# EAGLE design Telex-O (EAGLE 7.5.0)

## Sheet 1 of 2: POWER & IO
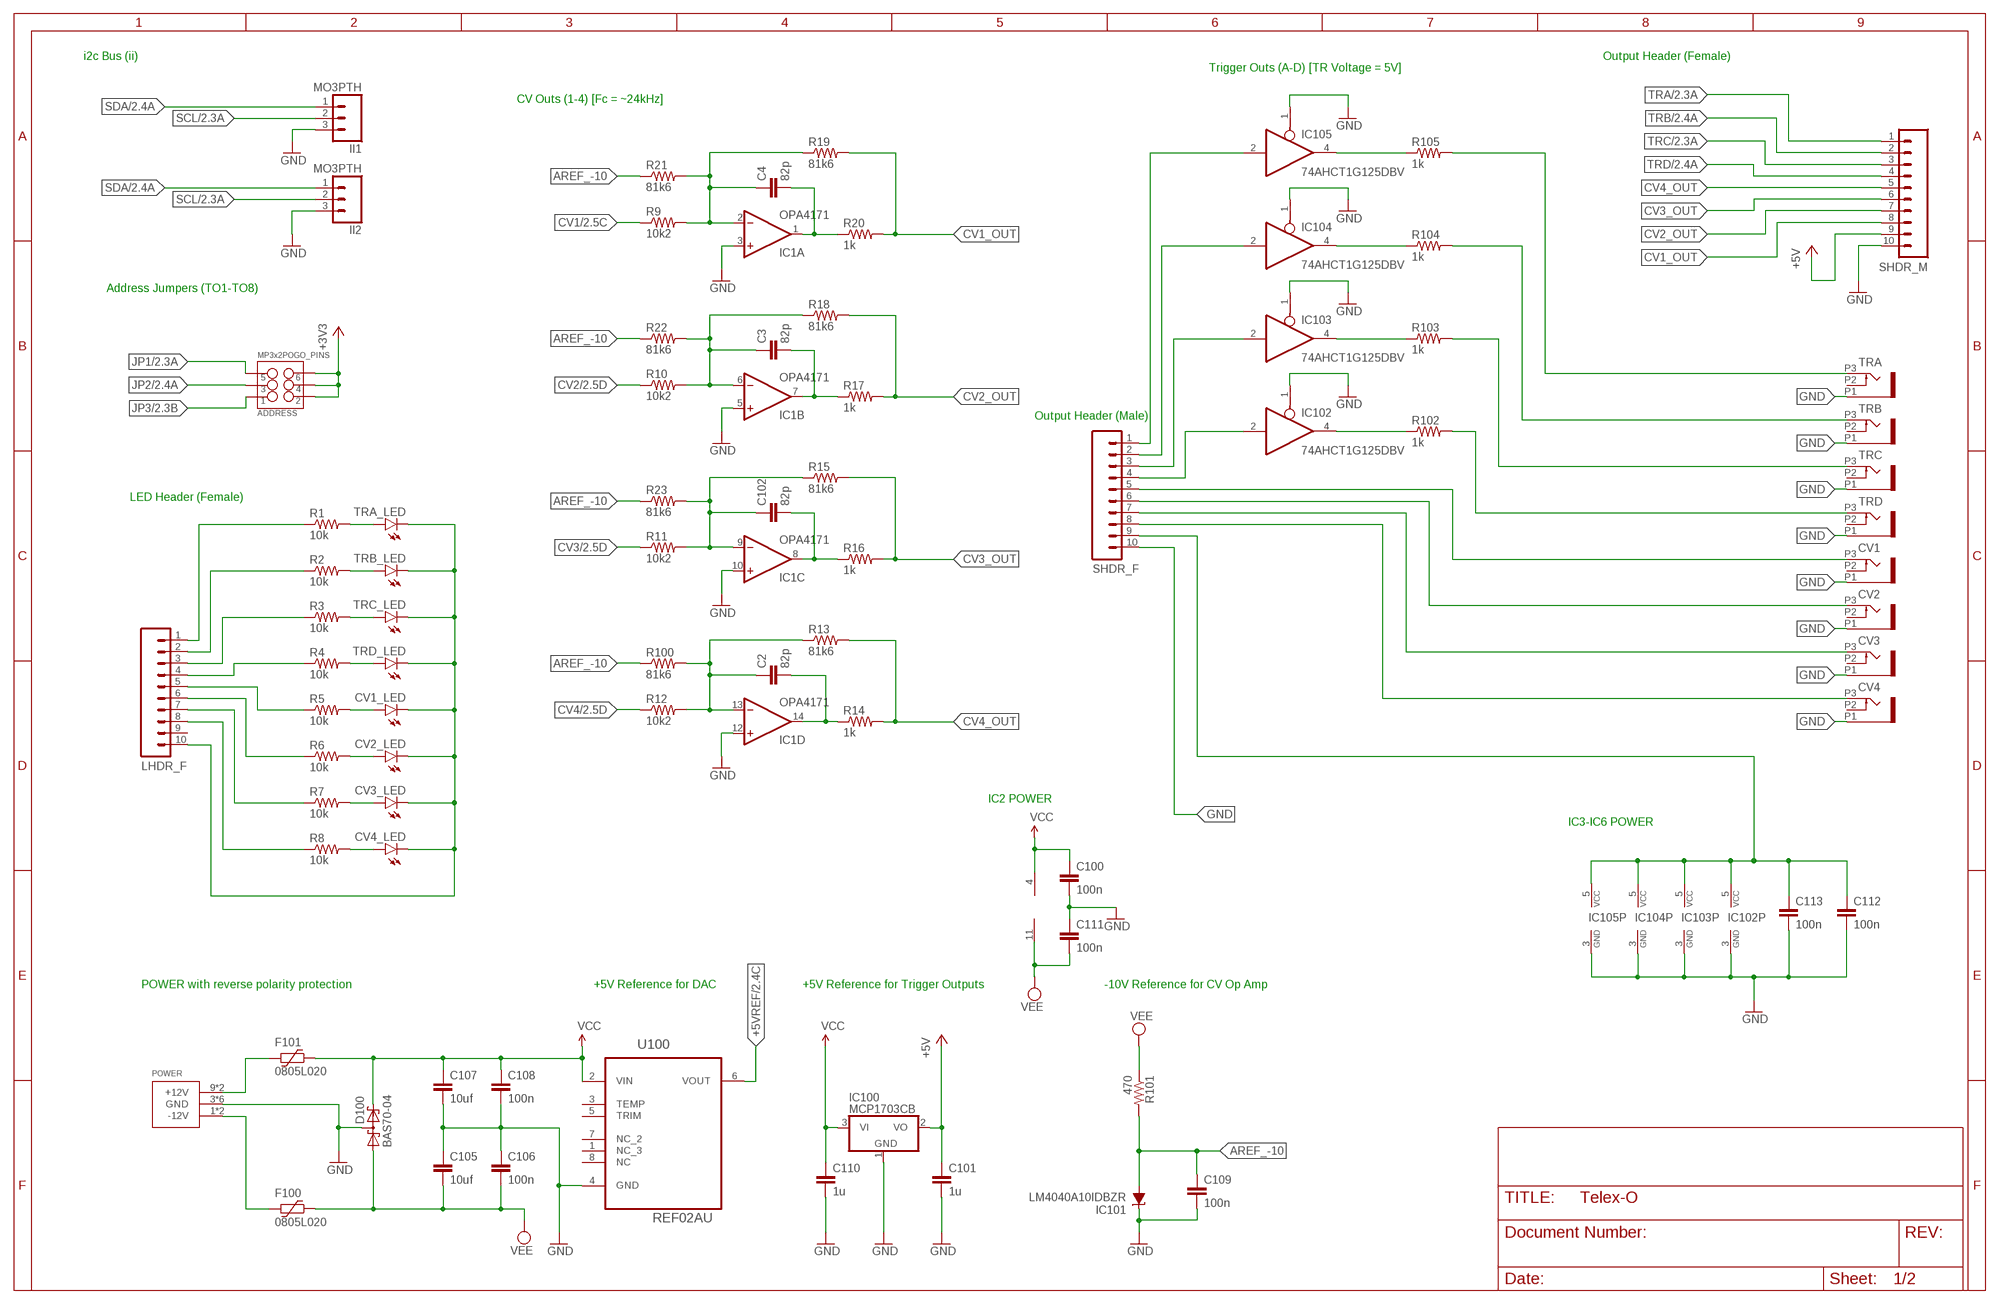
[diagram p0: schematic, sheet 1]

### Parts
ADDRESS  MP3x2POGO_PINS  M03X2POGO_PINS  [2X3_POGO]
C2  82p  CAP1206  [1206]
C3  82p  CAP1206  [1206]
C4  82p  CAP1206  [1206]
C100  100n  CAP0603-CAP  [0603-CAP]
C101  1u  CAP0603-CAP  [0603-CAP]
C102  82p  CAP1206  [1206]
C105  10uf  CAP1206  [1206]
C106  100n  CAP0603-CAP  [0603-CAP]
C107  10uf  CAP1206  [1206]
C108  100n  CAP0603-CAP  [0603-CAP]
C109  100n  CAP0603-CAP  [0603-CAP]
C110  1u  CAP0603-CAP  [0603-CAP]
C111  100n  CAP0603-CAP  [0603-CAP]
C112  100n  CAP0603-CAP  [0603-CAP]
C113  100n  CAP0603-CAP  [0603-CAP]
CV1  EURO_JACKS-7  [WQP_PJ_301M]
CV1_LED  LED3MM  [LED3MM]
CV2  EURO_JACKS-7  [WQP_PJ_301M]
CV2_LED  LED3MM  [LED3MM]
CV3  EURO_JACKS-7  [WQP_PJ_301M]
CV3_LED  LED3MM  [LED3MM]
CV4  EURO_JACKS-7  [WQP_PJ_301M]
CV4_LED  LED3MM  [LED3MM]
D100  BAS70-04  [SOT23]
F100  0805L020  [0805L]
F101  0805L020  [0805L]
IC1  OPA4171  TL074D  [SO14]
IC100  MCP1703CB  [SOT23]
IC101  LM4040A10IDBZR  LM4041A12DBZ  [DBZ_R-PDSO-G3]
IC102  74AHCT1G125DBV  [SOT23-5]
IC103  74AHCT1G125DBV  [SOT23-5]
IC104  74AHCT1G125DBV  [SOT23-5]
IC105  74AHCT1G125DBV  [SOT23-5]
II1  MO3PTH  M03PTH  [1X03]
II2  MO3PTH  M03PTH  [1X03]
LHDR_F  M10SILK_FEMALE_PTH  [1X10]
POWER  10-Pin  POWER_SIMPLE10  [POWER_10]
R1  10k  R-US_R0603  [R0603]
R2  10k  R-US_R0603  [R0603]
R3  10k  R-US_R0603  [R0603]
R4  10k  R-US_R0603  [R0603]
R5  10k  R-US_R0603  [R0603]
R6  10k  R-US_R0603  [R0603]
R7  10k  R-US_R0603  [R0603]
R8  10k  R-US_R0603  [R0603]
R9  10k2  R-US_R0603  [R0603]
R10  10k2  R-US_R0603  [R0603]
R11  10k2  R-US_R0603  [R0603]
R12  10k2  R-US_R0603  [R0603]
R13  81k6  R-US_R0603  [R0603]
R14  1k  R-US_R0603  [R0603]
R15  81k6  R-US_R0603  [R0603]
R16  1k  R-US_R0603  [R0603]
R17  1k  R-US_R0603  [R0603]
R18  81k6  R-US_R0603  [R0603]
R19  81k6  R-US_R0603  [R0603]
R20  1k  R-US_R0603  [R0603]
R21  81k6  R-US_R0603  [R0603]
R22  81k6  R-US_R0603  [R0603]
R23  81k6  R-US_R0603  [R0603]
R100  81k6  R-US_R0603  [R0603]
R101  470  R-US_R0603  [R0603]
R102  1k  R-US_R0603  [R0603]
R103  1k  R-US_R0603  [R0603]
R104  1k  R-US_R0603  [R0603]
R105  1k  R-US_R0603  [R0603]
SHDR_F  M10SILK_FEMALE_PTH  [1X10]
SHDR_M  M10SILK_FEMALE_PTH  [1X10]
TRA  EURO_JACKS-7  [WQP_PJ_301M]
TRA_LED  LED3MM  [LED3MM]
TRB  EURO_JACKS-7  [WQP_PJ_301M]
TRB_LED  LED3MM  [LED3MM]
TRC  EURO_JACKS-7  [WQP_PJ_301M]
TRC_LED  LED3MM  [LED3MM]
TRD  EURO_JACKS-7  [WQP_PJ_301M]
TRD_LED  LED3MM  [LED3MM]
U100  REF02AU  [SOIC127P600X175-8N]

### Nets
+3V3: ADDRESS.P$2 ADDRESS.P$4 ADDRESS.P$6 ; also sheet 2
+5V: C101.1 IC100.2(VO) SHDR_M.9 ; also sheet 2
+5VREF: U100.6(VOUT) ; also sheet 2
AREF_-10: C109.1 IC101.2(A) R21.1 R22.1 R23.1 R100.1 R101.2
CV1: R9.1 ; also sheet 2
CV1_OUT: R19.2 R20.2 SHDR_M.8
CV2: R10.1 ; also sheet 2
CV2_OUT: R17.2 R18.2 SHDR_M.7
CV3: R11.1 ; also sheet 2
CV3_OUT: R15.2 R16.2 SHDR_M.6
CV4: R12.1 ; also sheet 2
CV4_OUT: R13.2 R14.2 SHDR_M.5
GND: C100.2 C101.2 C105.1 C106.1 C107.2 C108.2 C109.2 C110.2 C111.1 C112.2 C113.2 CV1.P1 CV1_LED.K(C) CV2.P1 CV2_LED.K(C) CV3.P1 CV3_LED.K(C) CV4.P1 CV4_LED.K(C) D100.3(C1A2) IC1.3(A:+IN) IC1.5(B:+IN) IC1.10(C:+IN) IC1.12(D:+IN) IC100.1(GND) IC101.1(C) IC102.1(OE) IC102.3(GND) IC103.1(OE) IC103.3(GND) IC104.1(OE) IC104.3(GND) IC105.1(OE) IC105.3(GND) II1.3 II2.3 LHDR_F.10 POWER.3(GND) POWER.4(GND) POWER.5(GND) POWER.6(GND) POWER.7(GND) POWER.8(GND) SHDR_F.10 SHDR_M.10 TRA.P1 TRA_LED.K(C) TRB.P1 TRB_LED.K(C) TRC.P1 TRC_LED.K(C) TRD.P1 TRD_LED.K(C) U100.4(GND) ; also sheet 2
JP1: ADDRESS.P$5 ; also sheet 2
JP2: ADDRESS.P$3 ; also sheet 2
JP3: ADDRESS.P$1 ; also sheet 2
M$22: C4.1 IC1.2(A:-IN) R9.2 R19.1 R21.2
N$2: F101.2 POWER.9(+12V) POWER.10(+12V)
N$3: F100.2 POWER.1(-12V) POWER.2(-12V)
N$5: CV4_LED.A R8.2
N$7: IC105.2(I) SHDR_F.1
N$9: CV3_LED.A R7.2
N$10: CV2_LED.A R6.2
N$11: CV1_LED.A R5.2
N$12: R4.2 TRD_LED.A
N$13: R3.2 TRC_LED.A
N$14: R2.2 TRB_LED.A
N$15: R1.2 TRA_LED.A
N$17: IC104.2(I) SHDR_F.2
N$18: IC103.2(I) SHDR_F.3
N$19: C4.2 IC1.1(A:OUT) R20.1
N$20: IC102.2(I) SHDR_F.4
N$21: C3.2 IC1.7(B:OUT) R17.1
N$22: C3.1 IC1.6(B:-IN) R10.2 R18.1 R22.2
N$23: R102.2 TRD.P3
N$24: R103.2 TRC.P3
N$25: C102.2 IC1.8(C:OUT) R16.1
N$26: C102.1 IC1.9(C:-IN) R11.2 R15.1 R23.2
N$27: LHDR_F.1 R1.1
N$28: C2.2 IC1.14(D:OUT) R14.1
N$29: C2.1 IC1.13(D:-IN) R12.2 R13.1 R100.2
N$30: LHDR_F.2 R2.1
N$31: LHDR_F.3 R3.1
N$32: LHDR_F.4 R4.1
N$33: IC102.4(O) R102.1
N$34: IC103.4(O) R103.1
N$35: IC104.4(O) R104.1
N$36: IC105.4(O) R105.1
N$37: R104.2 TRB.P3
N$38: R105.2 TRA.P3
N$39: C112.1 C113.1 IC102.5(VCC) IC103.5(VCC) IC104.5(VCC) IC105.5(VCC) SHDR_F.9
N$40: CV3.P3 SHDR_F.7
N$41: LHDR_F.5 R5.1
N$42: LHDR_F.6 R6.1
N$43: LHDR_F.7 R7.1
N$44: LHDR_F.8 R8.1
N$45: CV1.P3 SHDR_F.5
N$46: CV2.P3 SHDR_F.6
N$47: CV4.P3 SHDR_F.8
SCL: II1.2 II2.2 ; also sheet 2
SDA: II1.1 II2.1 ; also sheet 2
TRA: SHDR_M.1 ; also sheet 2
TRB: SHDR_M.2 ; also sheet 2
TRC: SHDR_M.3 ; also sheet 2
TRD: SHDR_M.4 ; also sheet 2
VCC: C100.1 C107.1 C108.1 C110.1 D100.2(C2) F101.1 IC1.4(P:V+) IC100.3(VI) U100.2(VIN)
VEE: C105.2 C106.2 C111.2 D100.1(A1) F100.1 IC1.11(P:V-) R101.1
Unconnected: CV1.P2 CV2.P2 CV3.P2 CV4.P2 LHDR_F.9 TRA.P2 TRB.P2 TRC.P2 TRD.P2 U100.1(NC_3) U100.3(TEMP) U100.5(TRIM) U100.7(NC_2) U100.8(NC)

### Notes on the sheet
- i2c Bus (ii) | Output Header (Female)
- Trigger Outs (A-D) [TR Voltage = 5V]
- CV Outs (1-4) [Fc = ~24kHz]
- Address Jumpers (TO1-TO8)
- Output Header (Male)
- LED Header (Female)
- IC2 POWER
- IC3-IC6 POWER
- POWER with reverse polarity protection | +5V Reference for DAC | +5V Reference for Trigger Outputs | -10V Reference for CV Op Amp

## Sheet 2 of 2: LOGIC
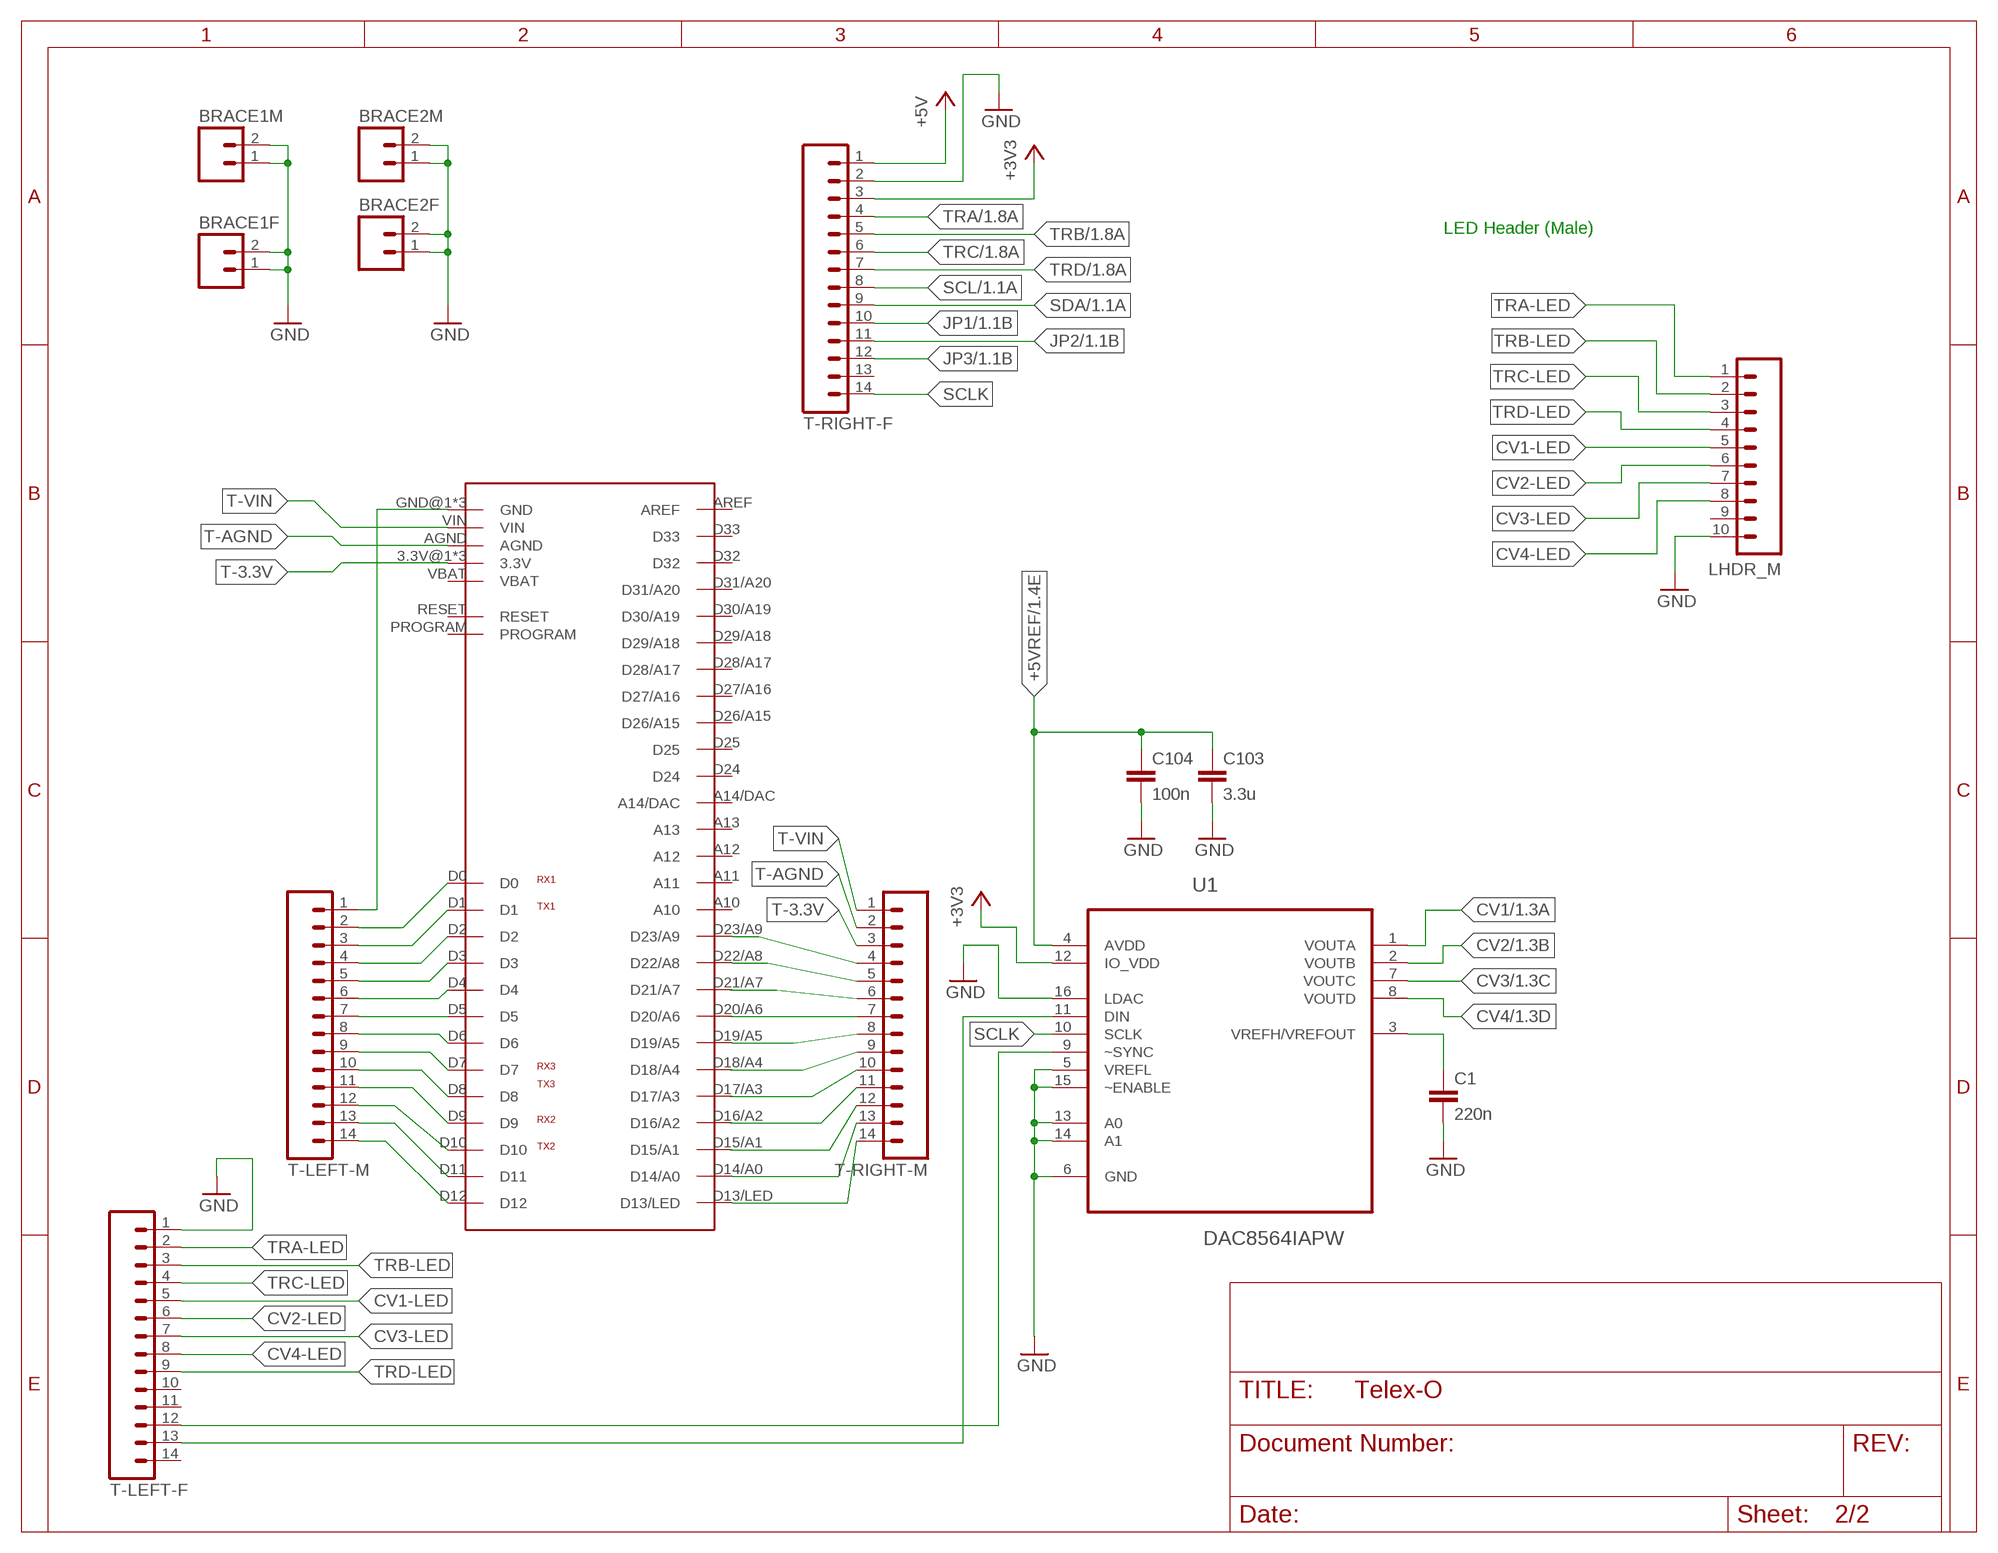
[diagram p1: schematic, sheet 2]

### Parts
BRACE1F  M02PTH  [1X02]
BRACE1M  M02PTH  [1X02]
BRACE2F  M02PTH  [1X02]
BRACE2M  M02PTH  [1X02]
C1  220n  CAP0603-CAP  [0603-CAP]
C103  3.3u  CAP1206  [1206]
C104  100n  CAP0603-CAP  [0603-CAP]
LHDR_M  M10SILK_FEMALE_PTH  [1X10]
T-LEFT-F  M14  [1X14]
T-LEFT-M  M14  [1X14]
T-RIGHT-F  M14  [1X14]
T-RIGHT-M  M14  [1X14]
U1  DAC8564IAPW  [SOP65P640X120-16N]
U$1  TEENSY3.1_ALL  [TEENSY3.1_ALL]

### Nets
+3V3: T-RIGHT-F.3 U1.12(IO_VDD) ; also sheet 1
+5V: T-RIGHT-F.1 ; also sheet 1
+5VREF: C103.1 C104.1 U1.4(AVDD) ; also sheet 1
CV1: U1.1(VOUTA) ; also sheet 1
CV1-LED: LHDR_M.5 T-LEFT-F.5
CV2: U1.2(VOUTB) ; also sheet 1
CV2-LED: LHDR_M.6 T-LEFT-F.6
CV3: U1.7(VOUTC) ; also sheet 1
CV3-LED: LHDR_M.7 T-LEFT-F.7
CV4: U1.8(VOUTD) ; also sheet 1
CV4-LED: LHDR_M.8 T-LEFT-F.8
GND: BRACE1F.1 BRACE1F.2 BRACE1M.1 BRACE1M.2 BRACE2F.1 BRACE2F.2 BRACE2M.1 BRACE2M.2 C1.2 C103.2 C104.2 LHDR_M.10 T-LEFT-F.1 T-RIGHT-F.2 U1.5(VREFL) U1.6(GND) U1.13(A0) U1.14(A1) U1.15(~ENABLE) U1.16(LDAC) ; also sheet 1
JP1: T-RIGHT-F.10 ; also sheet 1
JP2: T-RIGHT-F.11 ; also sheet 1
JP3: T-RIGHT-F.12 ; also sheet 1
N$1: T-RIGHT-M.14 U$1.D13/LED
N$4: T-LEFT-F.12 U1.9(~SYNC)
N$6: T-LEFT-F.13 U1.11(DIN)
N$8: C1.1 U1.3(VREFH/VREFOUT)
N$16: T-LEFT-M.2 U$1.D0
N$48: T-LEFT-M.3 U$1.D1
N$49: T-LEFT-M.4 U$1.D2
N$50: T-LEFT-M.5 U$1.D3
N$51: T-LEFT-M.6 U$1.D4
N$52: T-LEFT-M.7 U$1.D5
N$53: T-LEFT-M.8 U$1.D6
N$54: T-LEFT-M.9 U$1.D7
N$55: T-LEFT-M.12 U$1.D10
N$56: T-LEFT-M.13 U$1.D11
N$57: T-LEFT-M.1 U$1.GND@1(GND) U$1.GND@2(GND) U$1.GND@3(GND)
N$58: T-LEFT-M.10 U$1.D8
N$59: T-LEFT-M.11 U$1.D9
N$60: T-LEFT-M.14 U$1.D12
N$61: T-RIGHT-M.13 U$1.D14/A0
N$62: T-RIGHT-M.12
N$63: T-RIGHT-M.11
N$64: T-RIGHT-M.10
N$65: T-RIGHT-M.9
N$66: T-RIGHT-M.8 U$1.D19/A5
N$67: T-RIGHT-M.7
N$68: T-RIGHT-M.6
N$69: T-RIGHT-M.5 U$1.D22/A8
N$70: T-RIGHT-M.4 U$1.D23/A9
SCL: T-RIGHT-F.8 ; also sheet 1
SCLK: T-RIGHT-F.14 U1.10(SCLK)
SDA: T-RIGHT-F.9 ; also sheet 1
T-3.3V: T-RIGHT-M.3 U$1.3.3V@1(3.3V) U$1.3.3V@2(3.3V) U$1.3.3V@3(3.3V)
T-AGND: T-RIGHT-M.2 U$1.AGND
T-VIN: T-RIGHT-M.1 U$1.VIN
TRA: T-RIGHT-F.4 ; also sheet 1
TRA-LED: LHDR_M.1 T-LEFT-F.2
TRB: T-RIGHT-F.5 ; also sheet 1
TRB-LED: LHDR_M.2 T-LEFT-F.3
TRC: T-RIGHT-F.6 ; also sheet 1
TRC-LED: LHDR_M.3 T-LEFT-F.4
TRD: T-RIGHT-F.7 ; also sheet 1
TRD-LED: LHDR_M.4 T-LEFT-F.9
Unconnected: LHDR_M.9 T-LEFT-F.10 T-LEFT-F.11 T-LEFT-F.14 T-RIGHT-F.13 U$1.A10 U$1.A11 U$1.A12 U$1.A13 U$1.A14/DAC U$1.AREF U$1.D15/A1 U$1.D16/A2 U$1.D17/A3 U$1.D18/A4 U$1.D20/A6 U$1.D21/A7 U$1.D24 U$1.D25 U$1.D26/A15 U$1.D27/A16 U$1.D28/A17 U$1.D29/A18 U$1.D30/A19 U$1.D31/A20 U$1.D32 U$1.D33 U$1.PROGRAM U$1.RESET U$1.VBAT

### Notes on the sheet
- LED Header (Male)

## Library data of the parts
ADDRESS = SparkFun-Connectors:M03X2: 2x3 .1" header. Shrouded, with keying- CONN-10681 SMT- CONN-11415 Pogo pins- HW-11044; PROD_ID: HW-11044
BRACE1F BRACE1M BRACE2F BRACE2M = SparkFun-Connectors:M02: Standard 2-pin 0.1" header. Use with - straight break away headers ( PRT-00116) - right angle break away headers (PRT-00553) - swiss pins (PRT-00743) - machine pins (PRT-00117) - female headers (PRT-00115) Molex polarized connector foot print use with: PRT-08233 with associated crimp pins and housings. 2.54_SCREWTERM for use with PRT-10571. 3.5mm Screw Terminal footprints for PRT-08084 5mm Screw Terminal footprints for use with PRT-08432
C1-C4 C100-C113 = SparkFun-Passives:CAP: Capacitor Standard 0603 ceramic capacitor, and 0.1" leaded capacitor.
CV1-CV4 TRA TRB TRC TRD = tsyklon-labs:EURO_JACKS
CV1_LED CV2_LED CV3_LED CV4_LED TRA_LED TRB_LED TRC_LED TRD_LED = SparkFun-LED:LED: LEDs Standard schematic elements and footprints for 5mm, 3mm, 1206, and 0603 sized LEDs. 5mm - Spark Fun Electronics SKU : COM-00529 (and others); PROD_ID: DIO-08794
D100 = diode:BAS70-04: Silicon Schottky Diodes General-purpose diode for high-speed switching
F100 F101 = polyfuse-smd_10:?: Polyfuse Resettable PTC Source: http://www.littelfuse.com/products/resettable-ptcs.aspx; MF: Littelfuse; MPN: 0805L020; OC_FARNELL: 1832107; OC_NEWARK: 05M2226
IC1 = linear:TL074: OP AMP
IC100 = linear:MCP1703: 250 mA, 16V, Low Quiescent Current LDO Regulator Source: http://ww1.microchip.com/downloads/en/DeviceDoc/22049b.pdf
IC101 = texas:LM4041: PRECISION MICROPOWER SHUNT VOLTAGE REFERENCE Source: http://focus.ti.com/lit/ds/slcs146e/slcs146e.pdf; MPN: LM4041A12IDBZR; OC_FARNELL: 1407949; OC_NEWARK: 58K5875
IC102-IC105 = 74xx-little-us:74*1G125: Single Bus Buffer Gate with 3-State Output
II1 II2 = SparkFun-Connectors:M03: Header 3 Standard 3-pin 0.1" header. Use with straight break away headers (SKU : PRT-00116), right angle break away headers (PRT-00553), swiss pins (PRT-00743), machine pins (PRT-00117), and female headers (PRT-00115). Molex polarized connector foot print use with SKU : PRT-08232 with associated crimp pins and housings.
LHDR_F LHDR_M SHDR_F SHDR_M = SparkFun-Connectors:M10: Header 10 Standard 10-pin 0.1" header. Use with straight break away headers (SKU : PRT-00116), right angle break away headers (PRT-00553), swiss pins (PRT-00743), machine pins (PRT-00117), and female headers (PRT-00115).; PROD_ID: CONN-11563
POWER = eurorack:POWER_SIMPLE
R1-R23 R100-R105 = adafruit:R-US_: RESISTOR, American symbol
T-LEFT-F T-LEFT-M T-RIGHT-F T-RIGHT-M = SparkFun-Connectors:M14: Header 14 Standard 14-pin 0.1" header. Use with straight break away headers (SKU : PRT-00116), right angle break away headers (PRT-00553), swiss pins (PRT-00743), machine pins (PRT-00117), and female headers (PRT-00115).
U1 = Texas Instruments_By_element14_Batch_1:DAC8564IAPW: DAC; MPN: DAC8564IAPW; OC_FARNELL: 1536691; OC_NEWARK: 65M0703; PACKAGE: TSSOP-16; SUPPLIER: Texas Instruments
U100 = Texas Instruments_By_element14_Batch_1:REF02AU: VOLTAGE REFERENCE; MPN: REF02AU; OC_FARNELL: 1702825; OC_NEWARK: 80K6133; PACKAGE: SOIC-8; SUPPLIER: Texas Instruments
U$1 = Teensy3.1:TEENSY3.1_ALL

## Net classes
0 default: width 0.254 mm, drill 0.508 mm, clearance 0.203 mm

## Board
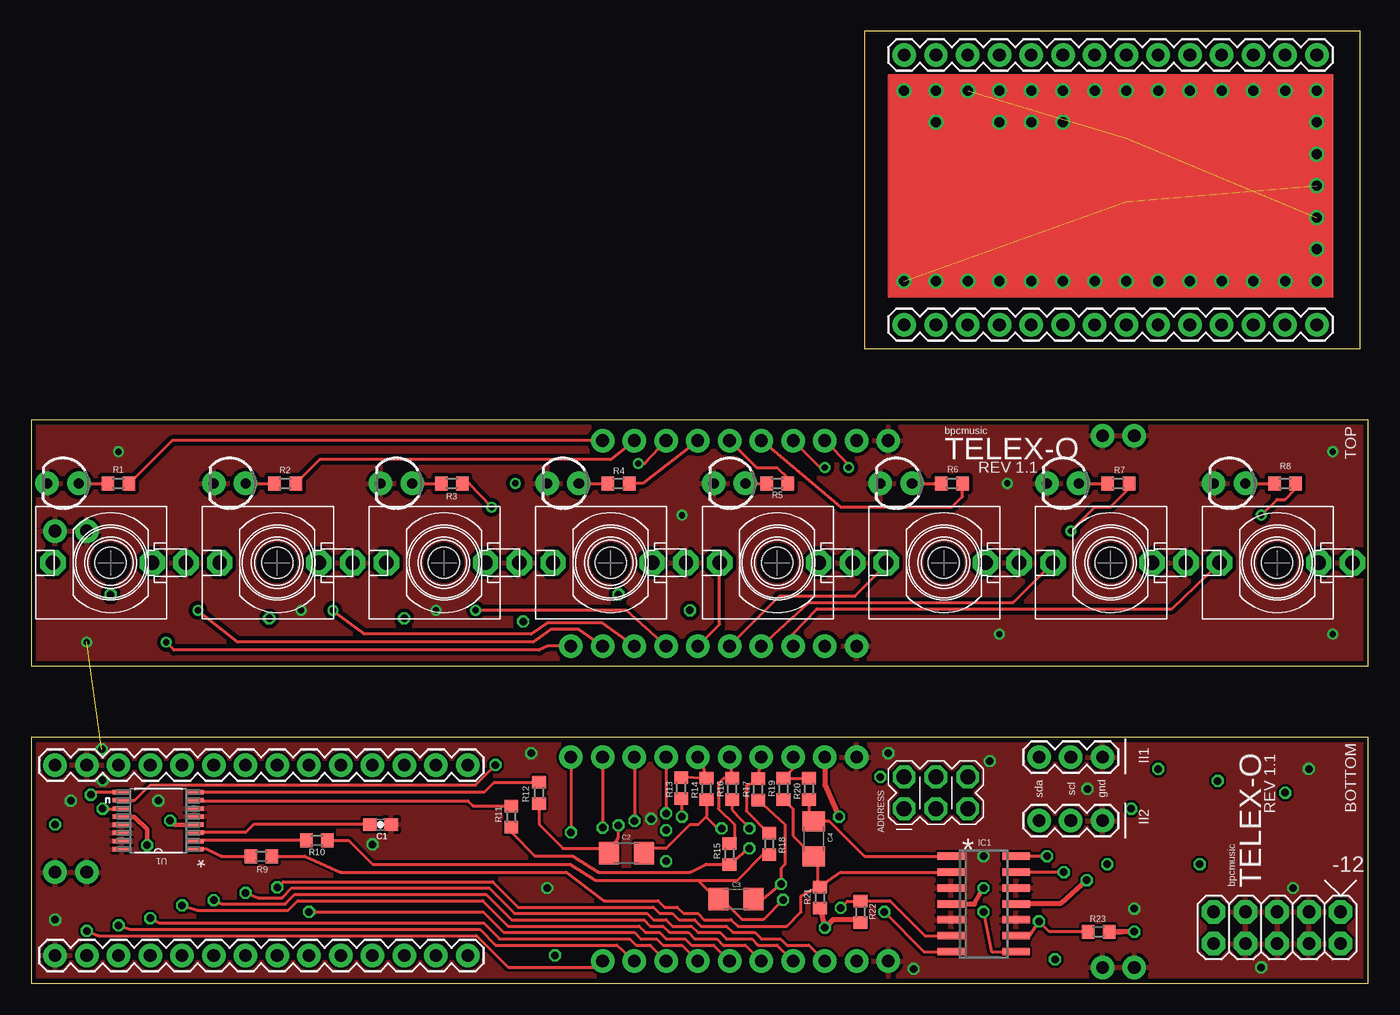
[diagram p2: board, top side]
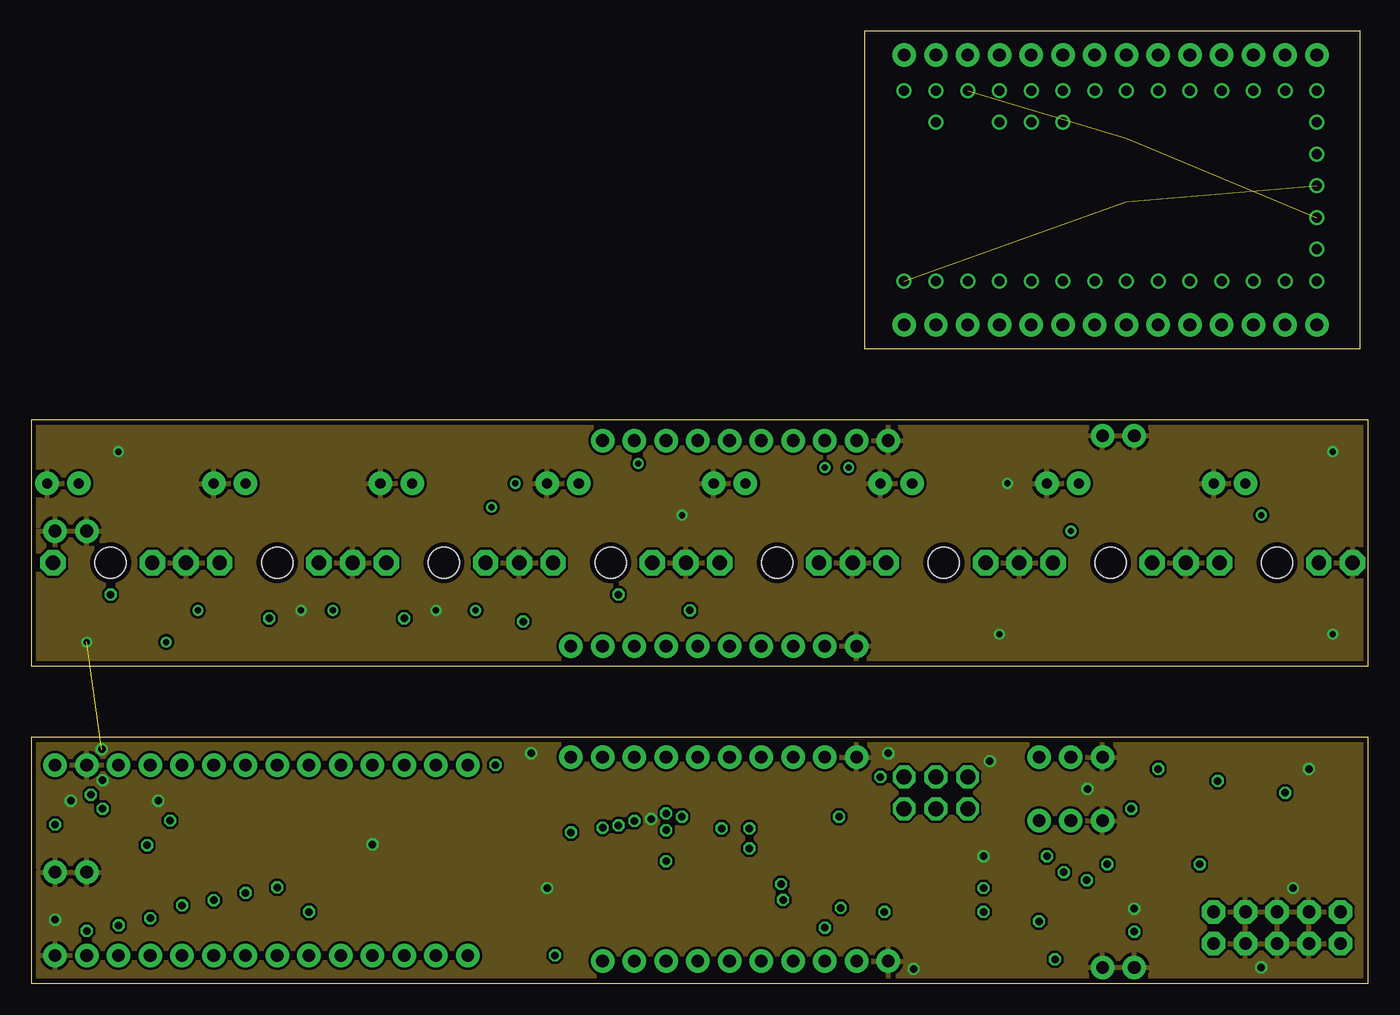
[diagram p3: board, inner layer Route2]
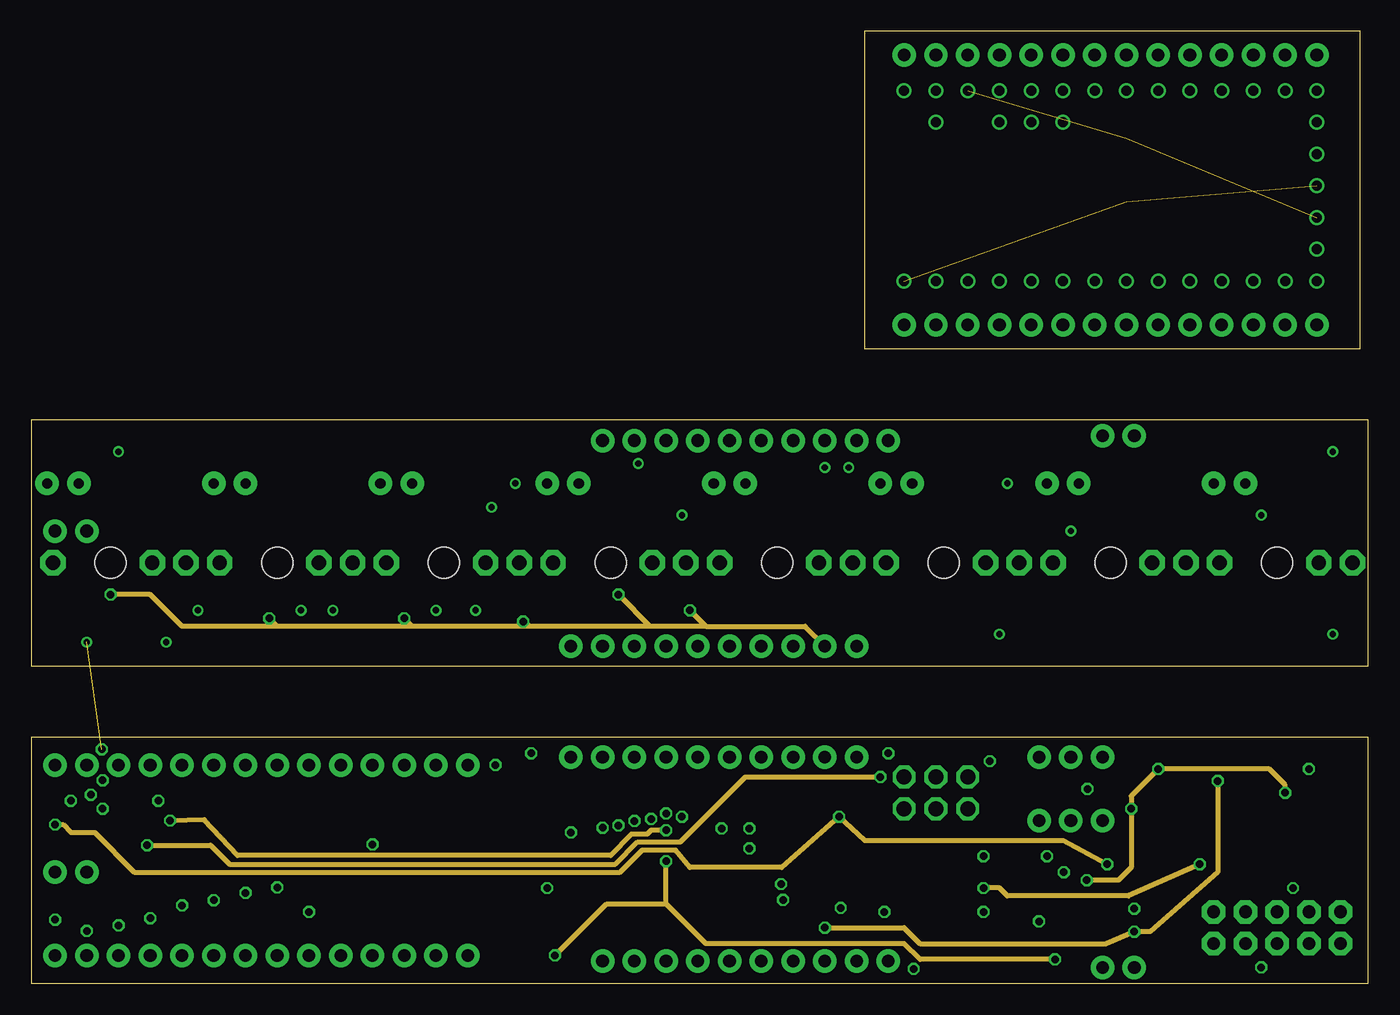
[diagram p4: board, inner layer Route15]
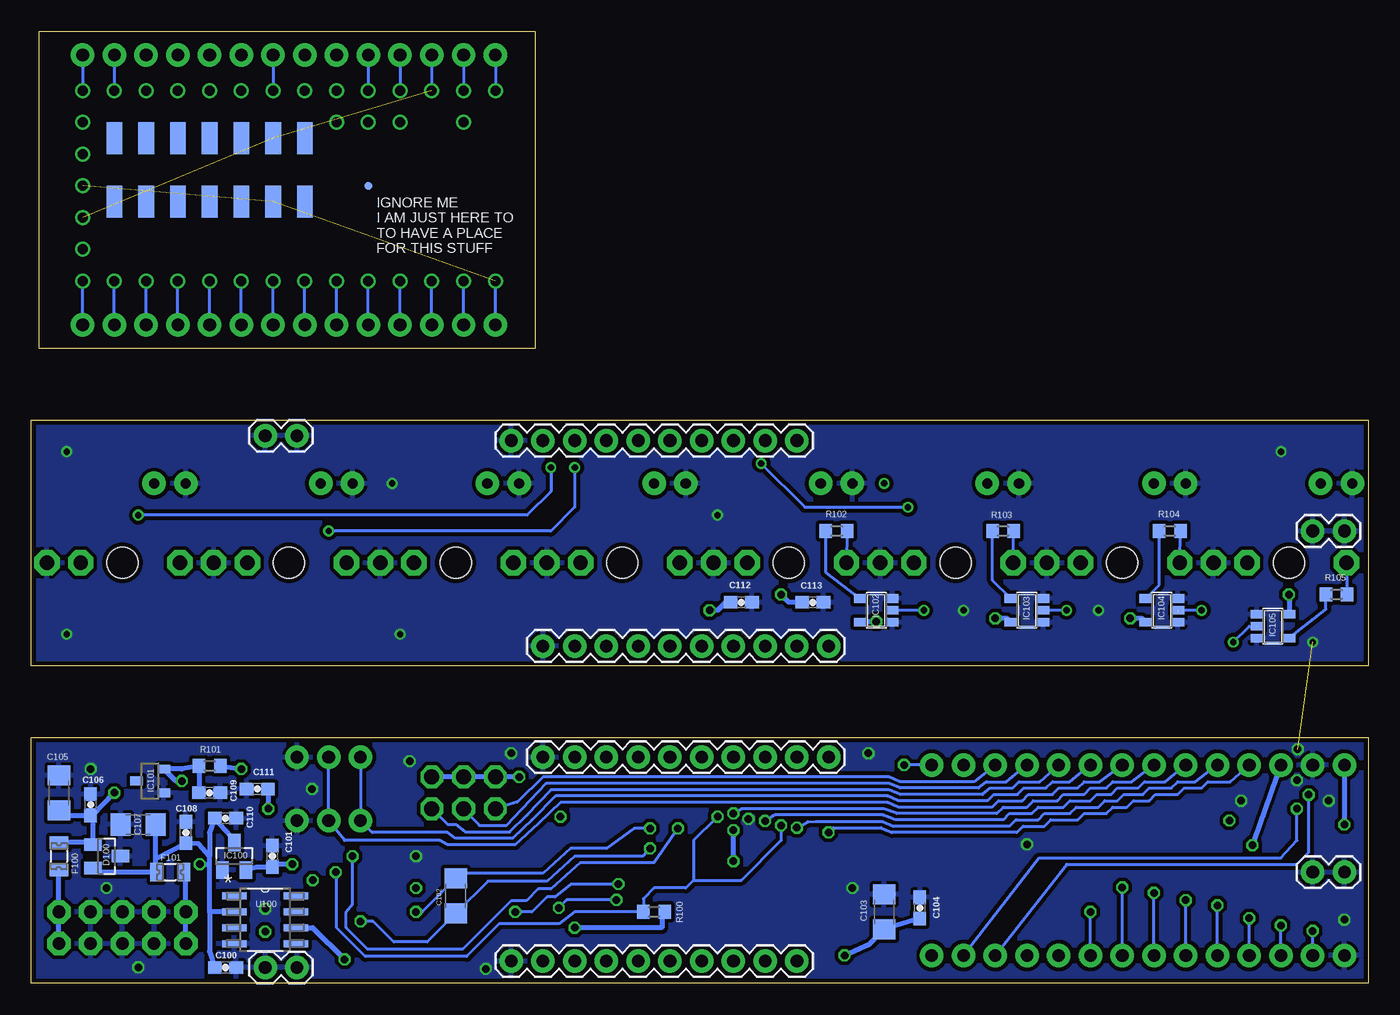
[diagram p5: board, bottom side, seen from below]

Size 106.98 x 76.19 mm. Coordinates in mm from the lower left corner, seen from the top.
Outline: 0,25.4 106.98,25.4 106.98,45.08 0,45.08 0,25.4
Outline: 0,0 106.98,0 106.98,19.68 0,19.68 0,0
Outline: 66.67,50.8 106.35,50.8 106.35,76.19 66.67,76.19 66.67,50.8
Copper layers (1*2*15*16): Top 0.0356mm / dielectric 1.5011mm / Route2 0.0356mm / dielectric 0.1499mm / Route15 0.0356mm / dielectric 0.2007mm / Bottom 0.0356mm
Design rules "LaenPCBOrder *": minimum track width 6mil, minimum drill 13mil, track to track 6mil, track to pad 6mil, pad to pad 6mil, via to via 6mil, smd to smd 6mil, copper to edge 15mil, drill to drill 6mil, minimum pad ring 7mil, minimum via ring 7mil, stop-mask expansion 3mil, vias tented up to drill 0mil, thermal gap 10mil

### Footprints (pad centres in the part's own frame; a part is rotated, then mirrored left to right if it is on the bottom)
2X3_POGO = drill 1.2 pad 1.829 octagon: P$1 0,0; P$2 0,2.54; P$3 2.54,0; P$4 2.54,2.54; P$5 5.08,0; P$6 5.08,2.54
1X02 = drill 1.016 pad 1.88: 1 0,0; 2 2.54,0
0603-CAP = smd 1.1 x 1: 1 -0.85,0; 2 0.85,0
1206 = smd 1.6 x 1.8: 1 -1.4,0; 2 1.4,0
WQP_PJ_301M = drill 1.143 pad 2.032 octagon: P1 0,-6.032; P2 0,-3.334; P3 0,4.604 | hole 2.5: 0,0
LED3MM = drill 0.813 pad 1.88: A -1.27,0; K 1.27,0
SOT23 = smd 1 x 1.4: 1 -0.95,-1.1; 2 0.95,-1.1; 3 0,1.1
0805L = smd 1 x 1.5: 1 -1.1,0; 2 1.1,0
SO14 = smd 0.6 x 2.2: 1 -3.81,-2.6; 2 -2.54,-2.6; 3 -1.27,-2.6; 4 0,-2.6; 5 1.27,-2.6; 6 2.54,-2.6; 7 3.81,-2.6; 8 3.81,2.6; 9 2.54,2.6; 10 1.27,2.6; 11 0,2.6; 12 -1.27,2.6; 13 -2.54,2.6; 14 -3.81,2.6
DBZ_R-PDSO-G3 = smd 0.7 x 1: 1 -0.95,-1.1; 2 0.95,-1.1; 3 0,1.1
SOT23-5 = smd 0.69 x 0.99: 1 -0.95,-1.29; 2 0,-1.29; 3 0.95,-1.29; 4 0.95,1.3; 5 -0.95,1.3
1X03 = drill 1.016 pad 1.88: 1 0,0; 2 2.54,0; 3 5.08,0
1X10 = drill 1.016 pad 1.88: 1 0,0; 2 2.54,0; 3 5.08,0; 4 7.62,0; 5 10.16,0; 6 12.7,0; 7 15.24,0; 8 17.78,0; 9 20.32,0; 10 22.86,0
POWER_10 = drill 1.016 pad 1.88 octagon: 1 -5.08,-1.27; 2 -5.08,1.27; 3 -2.54,-1.27; 4 -2.54,1.27; 5 0,-1.27; 6 0,1.27; 7 2.54,-1.27; 8 2.54,1.27; 9 5.08,-1.27; 10 5.08,1.27
R0603 = smd 1 x 1.1: 1 -0.85,0; 2 0.85,0
1X14 = drill 1.016 pad 1.88: 1 0,0; 2 2.54,0; 3 5.08,0; 4 7.62,0; 5 10.16,0; 6 12.7,0; 7 15.24,0; 8 17.78,0; 9 20.32,0; 10 22.86,0; 11 25.4,0; 12 27.94,0; 13 30.48,0; 14 33.02,0
SOP65P640X120-16N = smd 1.473 x 0.356: 1 -2.921,2.286; 2 -2.921,1.626; 3 -2.921,0.965; 4 -2.921,0.33; 5 -2.921,-0.33; 6 -2.921,-0.965; 7 -2.921,-1.626; 8 -2.921,-2.286; 9 2.921,-2.286; 10 2.921,-1.626; 11 2.921,-0.965; 12 2.921,-0.33; 13 2.921,0.33; 14 2.921,0.965; 15 2.921,1.626; 16 2.921,2.286
SOIC127P600X175-8N = smd 1.981 x 0.559: 1 -2.464,1.905; 2 -2.464,0.635; 3 -2.464,-0.635; 4 -2.464,-1.905; 5 2.464,-1.905; 6 2.464,-0.635; 7 2.464,0.635; 8 2.464,1.905
TEENSY3.1_ALL = drill 0.8: 3.3V@1 2.54,5.08; 3.3V@2 -7.62,-22.86; A10 0,0; A11 0,-2.54; A14/DAC 0,-22.86; AGND 2.54,7.62; AREF 0,2.54; D0 -12.7,7.62; D1 -12.7,5.08; D2 -12.7,2.54; D3 -12.7,0; D4 -12.7,-2.54; D5 -12.7,-5.08; D6 -12.7,-7.62; D7 -12.7,-10.16; D8 -12.7,-12.7; D9 -12.7,-15.24; D10 -12.7,-17.78; D11 -12.7,-20.32; D12 -12.7,-22.86; D13/LED 2.54,-22.86; D14/A0 2.54,-20.32; D15/A1 2.54,-17.78; D16/A2 2.54,-15.24; D17/A3 2.54,-12.7; D18/A4 2.54,-10.16; D19/A5 2.54,-7.62; D20/A6 2.54,-5.08; D21/A7 2.54,-2.54; D22/A8 2.54,0; D23/A9 2.54,2.54; GND@1 -12.7,10.16; GND@2 -5.08,-22.86; PROGRAM -2.54,-22.86; VBAT -10.16,-22.86; VIN 2.54,10.16; VUSB 0,7.62 | smd 2.54 x 1.27 bottom: 3.3V@3 -1.27,-7.62; A12 -6.35,-5.08; A13 -1.27,-5.08; D24 -6.35,-10.16; D25 -6.35,-12.7; D26/A15 -6.35,-15.24; D27/A16 -6.35,-17.78; D28/A17 -6.35,-20.32; D29/A18 -1.27,-20.32; D30/A19 -1.27,-17.78; D31/A20 -1.27,-15.24; D32 -1.27,-12.7; D33 -1.27,-10.16; GND@3 -6.35,-7.62 | smd 0.635 x 0.635 bottom: RESET -5.08,0

### Placement (x,y rotation side)
ADDRESS  69.85,13.97 0 top
BRACE1F  1.91,36.2 180 bottom
BRACE1M  1.91,8.89 180 bottom
BRACE2F  85.72,43.81 180 bottom
BRACE2M  85.72,1.27 180 bottom
C1  27.94,12.7 0 top
C2  47.62,10.41 0 top
C3  56.39,6.73 0 top
C4  62.61,11.56 90 top
C100  91.44,1.27 0 bottom
C101  87.69,10.16 90 bottom
C102  73.03,6.99 90 bottom
C103  38.73,5.71 90 bottom
C104  35.88,6.03 90 bottom
C105  104.78,15.24 270 bottom
C106  102.23,14.29 270 bottom
C107  98.42,12.7 180 bottom
C108  94.61,12.06 90 bottom
C109  92.71,15.24 0 bottom
C110  91.44,13.21 0 bottom
C111  88.9,15.56 0 bottom
C112  50.16,30.48 0 bottom
C113  44.45,30.48 0 bottom
CV1  59.69,33.66 90 top
CV1_LED  55.88,40.01 180 top
CV2  73.03,33.66 90 top
CV2_LED  69.22,40.01 180 top
CV3  86.36,33.66 90 top
CV3_LED  82.55,40.01 180 top
CV4  99.69,33.66 90 top
CV4_LED  95.89,40.01 180 top
D100  100.97,10.16 270 bottom
F100  104.78,10.16 270 bottom
F101  95.89,8.89 0 bottom
IC1  76.2,6.35 270 top
IC100  90.74,10.16 0 bottom
IC101  97.47,16.19 90 bottom
IC102  39.37,29.84 90 bottom
IC103  27.3,29.84 90 bottom
IC104  16.51,29.84 90 bottom
IC105  7.62,28.57 270 bottom
II1  80.64,18.1 0 top
II2  80.64,13.02 0 top
LHDR_F  45.72,43.43 180 bottom
LHDR_M  45.72,1.78 180 bottom
POWER  99.69,4.45 180 top
R1  6.99,40.01 180 top
R2  20.32,40.01 180 top
R3  33.66,40.01 180 top
R4  46.99,40.01 180 top
R5  59.69,40.01 180 top
R6  73.66,40.01 180 top
R7  87,40.01 180 top
R8  100.33,40.01 180 top
R9  18.41,10.16 0 top
R10  22.86,11.43 0 top
R11  38.42,13.34 270 top
R12  40.64,15.24 270 top
R13  52.01,15.62 90 top
R14  54.04,15.56 90 top
R15  55.88,10.33 90 top
R16  56.09,15.56 90 top
R17  58.17,15.53 90 top
R18  59.05,11.16 90 top
R19  60.2,15.56 90 top
R20  62.23,15.56 90 top
R21  63.12,6.86 90 top
R22  66.36,5.71 90 top
R23  85.41,4.13 180 top
R100  57.15,5.71 180 bottom
R101  92.71,17.4 180 bottom
R102  42.55,36.2 0 bottom
R103  29.21,36.2 0 bottom
R104  15.88,36.2 0 bottom
R105  2.54,31.11 0 bottom
SHDR_F  43.18,26.99 180 bottom
SHDR_M  43.18,18.1 180 bottom
T-LEFT-F  1.91,2.22 0 top
T-LEFT-M  69.85,52.7 0 top
T-RIGHT-F  1.91,17.46 0 top
T-RIGHT-M  69.85,74.3 0 top
TRA  6.35,33.66 90 top
TRA_LED  2.54,40.01 180 top
TRB  19.68,33.66 90 top
TRB_LED  15.88,40.01 180 top
TRC  33.02,33.66 90 top
TRC_LED  29.21,40.01 180 top
TRD  46.35,33.66 90 top
TRD_LED  42.55,40.01 180 top
U1  10.16,13.02 180 top
U100  88.27,5.08 0 bottom
U$1  80.01,68.9 90 top

### Tracks (layer width: path | path; a pad name or v marks a point on that pad's centre or on a via)
+3V3  (via drill 0.6)
  Top 0.356: v9.27,11.05 9.27,12.32 8.26,13.34 7.25,13.34 U1.12
  Route15 0.406: v9.27,11.05 14.35,11.05 15.88,9.53 46.74,9.53 48.51,11.3 51.94,11.3 57.15,16.51 v67.94,16.51
  Bottom 0.406: T-RIGHT-F.3 v9.27,11.05 | v67.94,16.51 ADDRESS.P$2 ADDRESS.P$4 ADDRESS.P$6
+5V  (via drill 0.6)
  Top 0.406: SHDR_M.9 63.5,15.88 v64.64,13.34
  Route15 0.406: v1.91,12.7 2.54,12.7 3.17,12.06 5.08,12.06 8.26,8.89 47.12,8.89 48.9,10.67 51.56,10.67 52.7,9.27 60.07,9.27 v64.64,13.34 66.67,11.43 82.55,11.43 v86.11,9.53
  Bottom 0.406: IC100.2 88.97,9.31 C101.1 | C101.1 87.73,9.53 | T-RIGHT-F.1 v1.91,12.7 | v86.11,9.53 87.95,9.53 C101.1
+5VREF  (via drill 0.6)
  Top 0.356: v11.11,13.02 11.44,12.69 U1.4
  Route15 0.406: v81.92,1.91 71.12,1.91 69.85,3.17 53.98,3.17 50.8,6.35 | v50.8,12.26 49.59,12.26 49.28,11.94 48.01,11.94 46.35,10.22 16.51,10.22 13.84,13.08 v11.11,13.02 | 50.8,6.35 v50.8,9.76 | v41.91,2.22 46.04,6.35 50.8,6.35
  Bottom 0.406: C104.1 C103.1 39.88,3.17 v41.91,2.22 | U100.6 84.45,4.45 v81.92,1.91 | v50.8,9.76 v50.8,12.26
AREF_-10  (via drill 0.6)
  Top 0.406: 87.31,4.13 R23.1 v88.27,4.13 | R21.1 v63.5,4.45 64.14,5.08 66.04,5.08 R22.1
  Route15 0.406: v94.93,16.19 94.93,8.89 89.53,4.13 v88.27,4.13 86.04,3.17 71.12,3.17 69.85,4.45 v63.5,4.45
  Bottom 0.406: C109.1 R101.2 94.93,17.14 IC101.2 95.42,16.19 v94.93,16.19 | R100.1 56.52,5.71 56.52,4.45 v63.5,4.45
CV1
  Top 0.254: U1.1 13.97,10.79 15.24,10.16 R9.1
CV1-LED  (via drill 0.6)
  Top 0.254: v12.06,6.22 13.34,5.84 20.57,5.84 21.34,6.6 36.13,6.6 38.16,4.57 48.64,4.57 49.15,4.06 50.29,4.06 50.8,3.56 52.32,3.56 52.83,3.05 54.61,3.05 LHDR_M.5
  Bottom 0.254: T-LEFT-F.5 v12.06,6.22
CV1_OUT
  Top 0.254: SHDR_M.8 60.96,17.17 R19.2 R20.2
CV2
  Top 0.254: R10.1 13.12,11.43 U1.2
CV2-LED  (via drill 0.6)
  Top 0.254: v14.61,6.66 15.24,6.35 20.32,6.35 21.08,7.11 36.39,7.11 38.42,5.08 49.02,5.08 49.53,4.57 50.55,4.57 51.05,4.06 52.58,4.06 53.09,3.56 54.86,3.56 55.37,3.05 57.15,3.05 LHDR_M.6
  Bottom 0.254: T-LEFT-F.6 v14.61,6.66
CV2_OUT
  Top 0.254: SHDR_M.7 R17.2 58.42,16.19 58.1,16.19 57.21,15.81 57.21,13.78 58.98,12.01 R18.2
CV3
  Top 0.254: U1.7 13.12,14.61 34.92,14.61 35.34,14.19 R11.1
CV3-LED  (via drill 0.6)
  Top 0.254: v17.14,7.24 18.16,6.86 20.07,6.86 20.83,7.62 36.64,7.62 38.67,5.59 49.28,5.59 49.78,5.08 50.8,5.08 51.31,4.57 52.83,4.57 53.34,4.06 55.12,4.06 55.63,3.56 57.66,3.56 58.17,3.05 59.69,3.05 LHDR_M.7
  Bottom 0.254: T-LEFT-F.7 v17.14,7.24
CV3_OUT
  Top 0.254: R15.2 56.26,11.31 56.26,12.7 54.99,13.97 54.99,16 55.4,16.41 R16.2 55.96,18.02 SHDR_M.6
CV4
  Top 0.254: U1.8 36.26,15.3 37.05,16.09 R12.1
CV4-LED  (via drill 0.6)
  Top 0.254: v19.68,7.67 20.19,8.13 36.92,8.13 38.95,6.1 49.78,6.1 50.29,5.59 51.31,5.59 51.82,5.08 53.09,5.08 53.59,4.57 55.63,4.57 56.13,4.06 57.91,4.06 58.42,3.56 59.94,3.56 60.45,3.05 62.23,3.05 LHDR_M.8
  Bottom 0.254: T-LEFT-F.8 v19.68,7.67
CV4_OUT
  Top 0.254: SHDR_M.5 53.66,17.78 R14.2 R13.2
GND  (via drill 0.51, 0.6)  (1 unrouted)
  other vias: 104.14,42.55 104.14,27.94 78.11,40.01 77.47,27.94 52.07,37.47 6.99,42.55 4.45,27.3 21.59,29.84 32.38,29.84 98.42,1.27 3.17,14.61 10.16,14.61 5.71,16.26 41.27,7.62 70.61,1.14 5.65,18.73 76.2,10.16 102.23,17.14 76.71,17.78 40.01,18.41 100.97,7.62 27.3,11.11 88.27,5.97 68.58,18.41 84.52,15.56 49.59,13.14 1.91,5.08
  pour Top (isolate 0.305): -0.64,45.72 107.95,45.72 107.95,24.77 -0.64,24.77
  pour Top (isolate 0.203): -0.64,20.32 107.95,20.32 107.95,-0.64 -0.64,-0.64
  pour Bottom (isolate 0.305): -0.64,45.72 107.95,45.72 107.95,24.77 -0.64,24.77
  pour Bottom (isolate 0.305): -0.64,20.32 107.95,20.32 108.58,20.32 108.58,-0.64 -0.64,-0.64
  pour Route2: -0.51,20.32 108.2,20.32 108.2,-0.51 -0.51,-0.51
  pour Route2: -0.51,45.72 107.7,45.72 107.7,24.89 -0.51,24.89
JP1
  Bottom 0.254: ADDRESS.P$5 73.66,12.7 73.03,12.7 72.26,12.11 68.71,12.11 67.31,13.46 65.41,15.49 38.35,15.49 37.47,15.11 30.86,15.11 30.23,15.62 28.45,15.62 27.94,16.13 26.29,16.13 T-RIGHT-F.10
JP2
  Bottom 0.254: ADDRESS.P$3 71.12,12.62 68.96,12.62 67.69,13.97 65.79,16 38.35,16 37.47,15.62 31.18,15.62 30.54,16.13 28.96,16.13 T-RIGHT-F.11
JP3
  Bottom 0.254: T-RIGHT-F.12 31.56,16.13 37.47,16.13 38.35,16.51 66.04,16.51 68.07,14.51 ADDRESS.P$1
M$22
  Top 0.254: R9.2 21.91,10.16 24.77,8.89 42.8,8.89 45.78,6.6 50.16,6.6 50.67,6.1 51.69,6.1 52.2,5.59 53.34,5.59 53.85,5.08 56.01,5.08 56.56,4.57 60.45,4.57 61.59,5.71 61.59,6.99 62.95,7.71 | IC1.2 64.77,8.89 R21.2 62.95,7.71 | R19.1 60.96,13.95 60.96,11.81 C4.1 62.95,9.81 62.95,7.71
N$1
  Bottom 0.254: T-RIGHT-M.14 U$1.D13/LED
N$2
  Bottom 0.406: POWER.10 POWER.9 94.61,8.72 F101.2
  Bottom 0.61: F101.2 94.61,8.89
N$3
  Bottom 0.406: POWER.2 POWER.1 F100.2
N$4  (via drill 0.6)
  Top 0.254: v4.76,15.08 5.14,15.3 U1.9
  Bottom 0.254: T-LEFT-F.12 24.13,9.53 5.71,9.53 4.76,10.48 v4.76,15.08
N$5
  Top 0.254: CV4_LED.A R8.2
N$6  (via drill 0.6)
  Top 0.254: v5.71,13.97 7.23,13.97 U1.11
  Bottom 0.254: T-LEFT-F.13 26.35,10.03 6.99,10.03 5.71,11.43 v5.71,13.97
N$7  (via drill 0.51)
  Top 0.254: SHDR_F.1 41.34,26.99 40.64,26.67 11.43,26.67 v10.79,27.3
  Bottom 0.254: v10.79,27.3 9.53,28.57 IC105.2
N$8
  Top 0.254: C1.1 17.78,12.7 17.14,12.06 13.09,12.06 U1.3
N$9
  Top 0.254: CV3_LED.A R7.2
N$10
  Top 0.254: CV2_LED.A R6.2
N$11
  Top 0.254: CV1_LED.A R5.2
N$12
  Top 0.254: TRD_LED.A R4.2
N$13
  Top 0.254: TRC_LED.A R3.2
N$14
  Top 0.254: TRB_LED.A R2.2
N$15
  Top 0.254: TRA_LED.A R1.2
N$16
  Bottom 0.254: T-LEFT-M.2 U$1.D0
N$17  (via drill 0.51)
  Top 0.254: SHDR_F.2 43.81,28.32 41.56,28.32 40.16,27.3 16.51,27.3 v13.34,29.84
  Bottom 0.254: v13.34,29.84 IC104.2
N$18  (via drill 0.51)
  Top 0.254: SHDR_F.3 45.72,28.83 41.27,28.83 40.01,27.94 26.67,27.94 v24.13,29.84
  Bottom 0.254: v24.13,29.84 IC103.2
N$19
  Top 0.254: R20.1 62.23,13.34 C4.2 63.88,12.96 66.67,10.16 IC1.1
N$20  (via drill 0.51)
  Top 0.254: SHDR_F.4 47.62,29.84 v35.56,29.84
  Bottom 0.254: v35.56,29.84 IC102.2
N$21  (via drill 0.6)
  Top 0.254: v68.26,5.71 71.44,2.54 IC1.7 | R17.1 60.33,12.71 60.33,9.53 60.01,9.21 v60.01,7.94 58.55,6.73 C3.2
  Bottom 0.254: v60.01,7.94 63.82,7.94 65.09,6.91 65.72,6.91 66.91,5.71 v68.26,5.71
N$22  (via drill 0.6)
  Top 0.254: 53.34,8.26 45.15,8.26 43.12,9.53 27.3,9.53 25.4,11.43 R10.2 | 53.34,8.26 56.52,8.26 58.57,10.31 R18.1 | v64.77,6.03 65.3,6.57 R22.2 66.08,6.6 68.71,6.6 71.5,3.81 IC1.6 | v60.17,6.67 58.58,5.08 56.9,5.08 55.5,6.48 C3.1 54.61,6.99 53.34,8.26
  Bottom 0.254: v60.17,6.67 64.14,6.67 v64.77,6.03
N$23
  Bottom 0.254: R102.2 TRD.P3
N$24
  Bottom 0.254: TRC.P3 R103.2
N$25  (via drill 0.6)
  Top 0.254: v76.2,5.71 76.83,2.54 IC1.8 | R16.1 56.09,13.89 v57.47,12.38
  Bottom 0.254: v57.47,12.38 58.74,12.38 60.96,10.79 63.82,10.79 66.04,8.81 72.6,8.81 C102.2 75.69,5.71 v76.2,5.71
N$26  (via drill 0.6)
  Top 0.254: IC1.9 79.88,3.81 v80.64,4.95 81.47,4.13 R23.2 | v57.47,10.79 57.44,10.79 R15.1 55.24,9.53 53.98,9.53 52.7,8.89 45.4,8.89 43.34,10.16 40.32,10.16 38.42,12.06 R11.2
  Bottom 0.254: v57.47,10.79 58.04,10.16 63.5,10.16 65.72,8.18 70.43,8.18 C102.1 75.31,3.3 77.98,3.3 79.63,4.95 v80.64,4.95
N$27
  Top 0.254: LHDR_F.1 11.26,43.43 R1.1
N$28  (via drill 0.6)
  Top 0.254: v81.28,10.16 IC1.14 | R14.1 54.04,13.36 53.99,13.32 | 53.99,13.32 53.38,12.7 52.7,12.7 50.8,10.79 49.41,10.79 C2.2 | v55.24,12.38 54.93,12.38 53.99,13.32
  Bottom 0.254: v55.24,12.38 57.15,9.65 63.06,9.65 65.41,7.54 66.42,7.54 67.36,6.6 68.58,6.6 72.45,2.73 80.07,2.73 81.79,4.45 81.79,5.71 81.28,6.35 v81.28,10.16
N$29  (via drill 0.6)
  Top 0.254: v82.61,8.89 IC1.13 | R12.2 40.64,12.7 42.55,10.79 45.84,10.79 C2.1 46.99,11.68 v46.99,12.64 | v52.07,13.34 52.07,14.71 R13.1
  Bottom 0.254: v82.61,8.89 82.55,8.83 82.55,4.45 80.26,2.16 72.14,2.16 69.53,4.76 64.77,4.76 63.5,5.71 R100.2 58,6.77 57.15,7.62 54.61,7.62 53.98,8.26 | 53.98,8.26 53.98,11.43 v52.07,13.34 | 53.98,8.26 50.16,8.26 46.99,11.43 v46.99,12.64
N$30
  Top 0.254: LHDR_F.2 46.35,41.91 23.07,41.91 R2.1
N$31  (via drill 0.51)
  Top 0.254: v36.83,38.1 35.05,40.01 R3.1 | LHDR_F.3 49.09,41.59 v48.58,41.59
  Bottom 0.254: v48.58,41.59 45.09,38.1 v36.83,38.1
N$32
  Top 0.254: LHDR_F.4 48.9,40.01 R4.1
N$33
  Bottom 0.254: IC102.4 43.4,32.88 R102.1
N$34
  Bottom 0.254: IC103.4 30.06,32.25 R103.1
N$35
  Bottom 0.254: IC104.4 16.73,31.88 R104.1
N$36
  Bottom 0.254: IC105.4 3.39,29.92 R105.1
N$37
  Bottom 0.254: TRB.P3 R104.2
N$38
  Bottom 0.254: TRA.P3 R105.2
N$39  (via drill 0.6)
  Route15 0.406: 53.98,28.57 49.53,28.57 | 49.53,28.57 40.01,28.57 | 40.01,28.57 30.48,28.57 | 30.48,28.57 19.68,28.57 | 19.68,28.57 12.06,28.57 9.53,31.11 v6.35,31.11 | v19.05,29.21 19.68,28.57 | v29.84,29.21 30.48,28.57 | v39.37,28.96 40.01,28.57 | v46.99,31.11 49.53,28.57 | v52.7,29.84 53.98,28.57 | 53.98,28.57 61.91,28.57 SHDR_F.9
  Bottom 0.254: C112.1 51.44,30.48 | C113.1 45.72,30.48
  Bottom 0.406: v6.35,31.11 6.32,31.09 IC105.5 | IC104.5 18.12,29.21 v19.05,29.21 | IC103.5 28.92,29.21 v29.84,29.21 | IC102.5 40.35,28.96 v39.37,28.96 | 45.72,30.48 46.35,30.48 v46.99,31.11 | 51.44,30.48 52.07,29.84 v52.7,29.84
N$40
  Top 0.254: SHDR_F.7 62.23,30.48 78.58,30.48 CV3.P3
N$41
  Top 0.254: LHDR_F.5 58.04,41.27 59.69,41.27 60.54,40.42 R5.1
N$42
  Top 0.254: LHDR_F.6 64.77,38.1 73.66,38.1 74.51,38.95 R6.1
N$43  (via drill 0.51)
  Top 0.254: v83.19,36.2 85.09,38.1 86.36,38.1 87.84,39.59 R7.1 | LHDR_F.7 63.12,41.27 v63.5,41.27
  Bottom 0.254: v63.5,41.27 63.5,38.1 65.41,36.2 v83.19,36.2
N$44  (via drill 0.51)
  Top 0.254: v98.42,37.47 99.69,38.73 100.33,38.73 101.18,39.59 R8.1 | LHDR_F.8 65.41,41.53 v65.41,41.27
  Bottom 0.254: v65.41,41.27 65.41,39.37 67.31,37.47 v98.42,37.47
N$45
  Top 0.254: SHDR_F.5 55.09,28.73 CV1.P3
N$46
  Top 0.254: SHDR_F.6 59.88,30.99 65.91,30.99 68.42,33.5 CV2.P3
N$47
  Top 0.254: SHDR_F.8 60.96,27.94 62.87,29.97 91.28,29.97 CV4.P3
N$48
  Bottom 0.254: T-LEFT-M.3 U$1.D1
N$49
  Bottom 0.254: T-LEFT-M.4 U$1.D2
N$50
  Bottom 0.254: T-LEFT-M.5 U$1.D3
N$51
  Bottom 0.254: T-LEFT-M.6 U$1.D4
N$52
  Bottom 0.254: T-LEFT-M.7 U$1.D5
N$53
  Bottom 0.254: T-LEFT-M.8 U$1.D6
N$54
  Bottom 0.254: T-LEFT-M.9 U$1.D7
N$55
  Bottom 0.254: T-LEFT-M.12 U$1.D10
N$56
  Bottom 0.254: T-LEFT-M.13 U$1.D11
N$57  (2 unrouted)
  Bottom 0.254: T-LEFT-M.1 U$1.GND@1
N$58
  Bottom 0.254: T-LEFT-M.10 U$1.D8
N$59
  Bottom 0.254: T-LEFT-M.11 U$1.D9
N$60
  Bottom 0.254: T-LEFT-M.14 U$1.D12
N$61
  Bottom 0.254: T-RIGHT-M.13 U$1.D14/A0
N$66
  Bottom 0.254: T-RIGHT-M.8 U$1.D19/A5
N$69
  Bottom 0.254: T-RIGHT-M.5 U$1.D22/A8
N$70
  Bottom 0.254: T-RIGHT-M.4 U$1.D23/A9
N$77  (via drill 0.51)
  other vias: 38.73,40.01
SCL
  Bottom 0.254: T-RIGHT-F.8 21.46,16.13 22.73,16.13 23.24,15.62 24.77,15.62 25.27,15.11 27.18,15.11 27.69,14.61 29.59,14.61 30.1,14.1 37.59,14.1 38.48,14.48 64.64,14.48 66.42,12.76 68.26,11.1 73.66,11.1 74.3,11.43 81.92,11.43 II2.2 II1.2
SCLK  (via drill 0.6)
  Top 0.254: U1.10 8.29,14.64 9.53,15.88 35.56,15.88 v37.15,17.46
  Bottom 0.254: T-RIGHT-F.14 v37.15,17.46
SDA
  Bottom 0.254: T-RIGHT-F.9 23.88,16.13 25.27,16.13 25.78,15.62 27.56,15.62 28.07,15.11 29.97,15.11 30.48,14.61 37.59,14.61 38.48,14.99 65.02,14.99 66.93,13.08 68.45,11.61 73.03,11.61 73.66,12.06 79.69,12.06 II2.1 II1.1
T-3.3V  (2 unrouted)
  Bottom 0.254: T-RIGHT-M.3 U$1.3.3V@1
T-AGND
  Bottom 0.254: T-RIGHT-M.2 U$1.AGND
T-VIN
  Bottom 0.254: T-RIGHT-M.1 U$1.VIN
TRA  (via drill 0.6)
  Top 0.254: SHDR_M.1 v43.18,12.06
  Bottom 0.254: v43.18,12.06 42.8,12.45 38.99,12.45 38.1,12.06 28.13,12.06 27.62,12.57 25.91,12.57 25.4,13.08 23.24,13.08 22.73,13.59 20.95,13.59 20.45,14.1 19.3,14.1 18.8,14.61 17.53,14.61 17.02,15.11 15.24,15.11 14.73,15.62 13.34,15.62 12.83,16.13 11.05,16.13 T-RIGHT-F.4
TRA-LED  (via drill 0.6)
  Top 0.254: v4.45,4.19 5.4,3.81 35.62,3.81 38.16,1.27 45.21,1.27 LHDR_M.1
  Bottom 0.254: T-LEFT-F.2 v4.45,4.19
TRB  (via drill 0.6)
  Top 0.254: SHDR_M.2 v45.72,12.45
  Bottom 0.254: v45.72,12.45 44.85,12.94 44.21,12.95 38.86,12.95 37.97,12.57 28.7,12.57 28.19,13.08 26.42,13.08 25.91,13.59 23.88,13.59 23.37,14.1 21.59,14.1 21.08,14.61 20.07,14.61 19.56,15.11 18.03,15.11 17.53,15.62 15.75,15.62 15.24,16.13 13.84,16.13 T-RIGHT-F.5
TRB-LED  (via drill 0.6)
  Top 0.254: v6.99,4.62 7.94,4.32 35.9,4.32 37.17,3.05 46.86,3.05 LHDR_M.2
  Bottom 0.254: T-LEFT-F.3 v6.99,4.62
TRC  (via drill 0.6)
  Top 0.254: SHDR_M.3 v48.26,12.99
  Bottom 0.254: v48.26,12.99 47.5,13.46 38.86,13.46 37.85,13.08 29.21,13.08 28.7,13.59 26.92,13.59 26.42,14.1 24.38,14.1 23.88,14.61 22.23,14.61 21.72,15.11 20.57,15.11 20.07,15.62 18.41,15.62 17.91,16.13 16.26,16.13 T-RIGHT-F.6
TRC-LED  (via drill 0.6)
  Top 0.254: v9.53,5.21 10.22,4.83 36.2,4.83 37.47,3.56 47.88,3.56 48.39,3.05 49.53,3.05 LHDR_M.3
  Bottom 0.254: T-LEFT-F.4 v9.53,5.21
TRD  (via drill 0.6)
  Top 0.254: SHDR_M.4 v50.8,13.59
  Bottom 0.254: v50.8,13.59 50.16,13.97 38.73,13.97 37.72,13.59 29.72,13.59 29.21,14.1 27.3,14.1 26.8,14.61 24.89,14.61 24.38,15.11 22.73,15.11 22.23,15.62 20.95,15.62 20.45,16.13 18.92,16.13 T-RIGHT-F.7
TRD-LED  (via drill 0.6)
  Top 0.254: LHDR_M.4 52.07,3.05 50.55,3.05 50.04,3.56 48.77,3.56 48.26,4.06 37.81,4.06 36.16,5.71 v22.23,5.71
  Bottom 0.254: T-LEFT-F.9 v22.23,5.71
VCC  (via drill 0.6)
  Top 0.406: IC1.4 75.49,6.35 v76.2,7.62
  Route15 0.406: v93.5,9.53 87.79,6.99 78.11,6.99 77.47,7.62 v76.2,7.62
  Bottom 0.406: 97.03,8.89 102.06,8.89 D100.2 | F101.1 97.03,8.89 | 97.03,8.89 97.03,9.95 | 97.03,9.95 C107.1 | 97.03,9.95 C108.1 93.6,11.18 92.71,10.16 | U100.2 92.71,5.71 | 92.71,5.71 92.71,9.53 | 92.71,9.53 92.71,10.16 | 92.71,10.16 92.71,12.06 C110.1 90.53,11.26 IC100.3 | 92.71,5.71 92.71,2.54 C100.1 | v93.5,9.53 92.71,9.53
VEE  (via drill 0.6)
  Top 0.406: IC1.11 79.88,6.41 82.42,6.41 v84.45,8.26
  Route15 0.406: v100.33,15.24 100.33,15.88 99.06,17.14 v90.17,17.14 88.01,14.99 v88.01,13.97 88.01,9.27 87,8.26 v84.45,8.26
  Bottom 0.406: C105.2 104.37,13.44 C106.2 102.06,13.44 | F100.1 102.22,11.26 D100.1 102.06,13.44 | 102.06,13.44 v100.33,15.24 | C111.2 87.95,15.24 88.01,15.18 v88.01,13.97 | R101.1 v90.17,17.14

### Text on the board
bPlace: IGNORE ME / I AM JUST HERE TO / TO HAVE A PLACE / FOR THIS STUFF
tNames: bpcmusic | TELEX-O | TOP | REV 1.1 | __ | sda | scl | gnd | REV 1.1 | BOTTOM | __ | * | bpcmusic | TELEX-O